# EAGLE design gate-emitter (EAGLE 7.6.0)
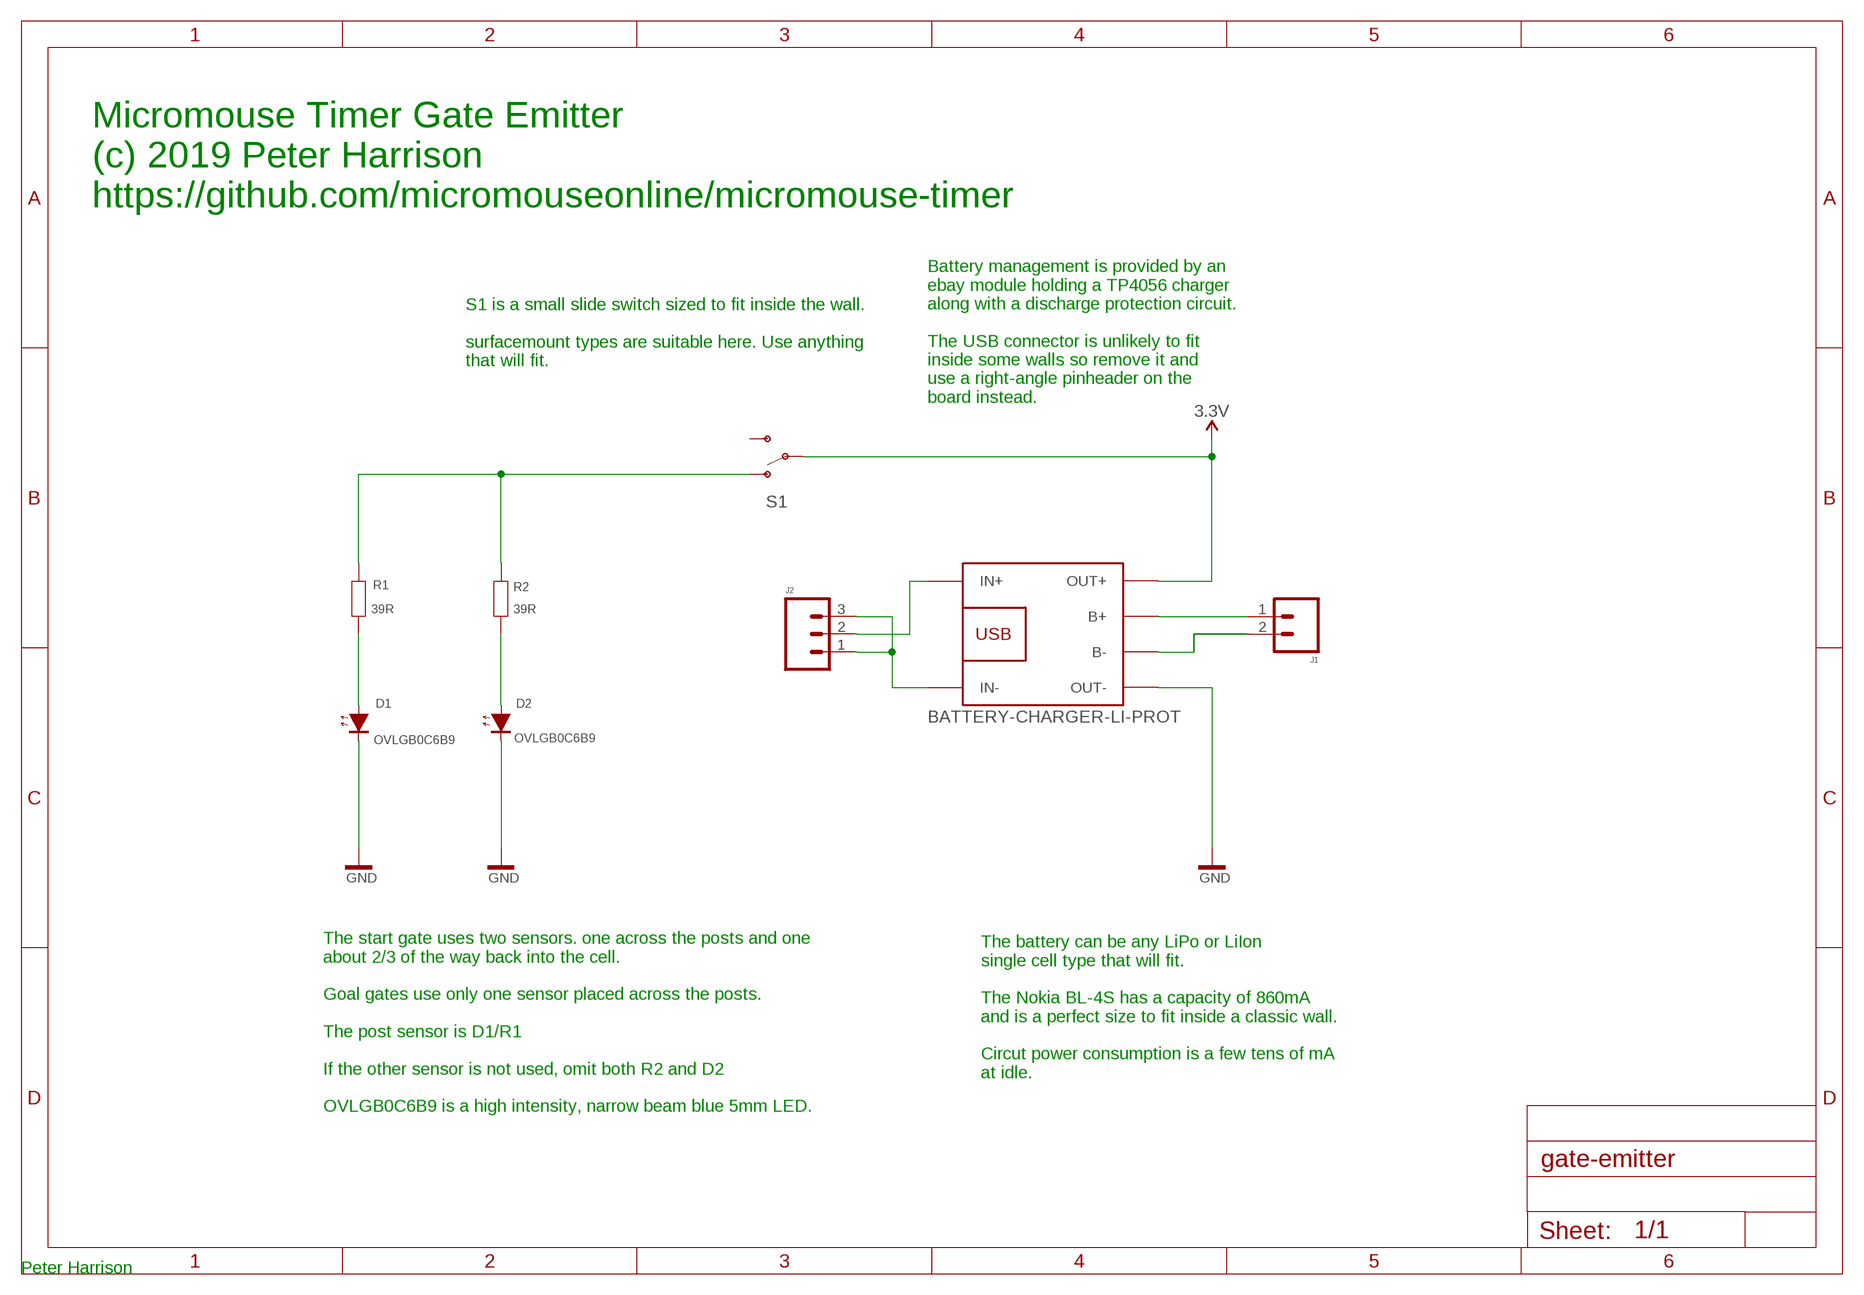
[diagram p0: schematic, sheet 1]
FRAME1 (A4L-LOC): NME: Peter Harrison

## Parts
D1  OVLGB0C6B9  LED  [LED5MM-H]
D2  OVLGB0C6B9  LED  [LED5MM-H]
J1  M02RA_MALE_MILL  [1X02_RA_PTH_MALE_MILL]
J2  M03RA_MALE  [1X03_RA_PTH_MILL]
R1  39R  RESISTOR_AXIAL-0207_0.4  [AXIAL-0207_0.4]
R2  39R  RESISTOR_AXIAL-0207_0.4  [AXIAL-0207_0.4]
S1  SWITCH-SPDT-PTH-11.6X4.0MM  [SWITCH_SPDT_PTH_11.6X4.0MM]
U$2  BATTERY-CHARGER-LI-PROT  [BATTERY-CHARGER-LI-PROT]

## Nets
3.3V: S1.2(P) U$2.OUT+
GND: D1.C D2.C U$2.OUT-
N$1: R1.2 R2.2 S1.1(O)
N$2: J1.1 U$2.B+
N$3: D1.A R1.1
N$4: D2.A R2.1
N$5: J2.2 U$2.IN+
N$6: J2.1 J2.3 U$2.IN-
N$7: J1.2 U$2.B-
Unconnected: S1.3(S)

## Notes on the sheet
- Micromouse Timer Gate Emitter
  (c) 2019 Peter Harrison
  https://github.com/micromouseonline/micromouse-timer
- S1 is a small slide switch sized to fit inside the wall.
  
  surfacemount types are suitable here. Use anything
  that will fit.
- Battery management is provided by an 
  ebay module holding a TP4056 charger 
  along with a discharge protection circuit.
  
  The USB connector is unlikely to fit
  inside some walls so remove it and
  use a right-angle pinheader on the
  board instead.
- The battery can be any LiPo or LiIon 
  single cell type that will fit.
  
  The Nokia BL-4S has a capacity of 860mA
  and is a perfect size to fit inside a classic wall.
  
  Circut power consumption is a few tens of mA 
  at idle.
- The start gate uses two sensors. one across the posts and one
  about 2/3 of the way back into the cell.
  
  Goal gates use only one sensor placed across the posts.
  
  The post sensor is D1/R1
  
  If the other sensor is not used, omit both R2 and D2
  
  OVLGB0C6B9 is a high intensity, narrow beam blue 5mm LED.

## Library data of the parts
D1 D2 = micromouse-timer:LED
J1 = micromouse-timer:M02: 2 pin header/connector
J2 = micromouse-timer:M03: Header 3 Standard 3-pin 0.1" header. Use with straight break away headers (SKU : PRT-00116), right angle break away headers (PRT-00553), swiss pins (PRT-00743), machine pins (PRT-00117), and female headers (PRT-00115). Molex polarized connector foot print use with SKU : PRT-08232 with associated crimp pins and housings.
R1 R2 = micromouse-timer:RESISTOR_: Resistor Basic schematic elements and footprints for 0603, 1206, and PTH 1/10th watt (small) resistors.
S1 = micromouse-timer:SWITCH-SPDT: Single Pole, Double Throw (SPDT) Switch Single-pole, double-throw (SPDT) switch. Variant Overview SMD-AYZ0202 Surface Mount DPDT Switch <https://www.sparkfun.com/products/597> (COM-00597) Used on e.g. LilyPad Arduino USB - ATmega32U4 Board <https://www.sparkfun.com/products/12049> PTH-11.6X4.0MM SPDT Mini Power Switch <https://www.sparkfun.com/products/102> (COM-00102) Used on e.g. SparkFun Simon Says - Through-Hole Soldering Kit <https://www.sparkfun.com/products/10547> (KIT-10547) PTH-11.6X4.0MM-KIT KIT version of SPDT Mini Power Switch - Simplifies soldering by removing tStop of switch pins - only one side can be soldered. PTH-11.6X4.0MM-LOCK LOCK version of SPDT Mini Power Switch - Offset pins hold switch in place for easier soldering. SMD-RIGHT-ANGLE Surface Mount Right Angle Switch <https://www.sparkfun.com/products/10860> (COM-10860) Used on e.g. SparkFun ESP8266 Thing <https://www.sparkfun.com/products/13231>; PROD_ID: SWCH-08261; SF_SKU: COM-00102
U$2 = micromouse-timer:BATTERY-CHARGER-LI-PROT: Lithium Battery 5V Charger with protection circuit More details available here: http://www.instructables.com/id/DIY-Lithium-ion-Battery-Charger/step4/TP4056-based-lithium-ion-battery-charger-module/ Click here to find device on ebay.com <http://www.ebay.com/sch/tp4056+charger+usb+protection>

## Board
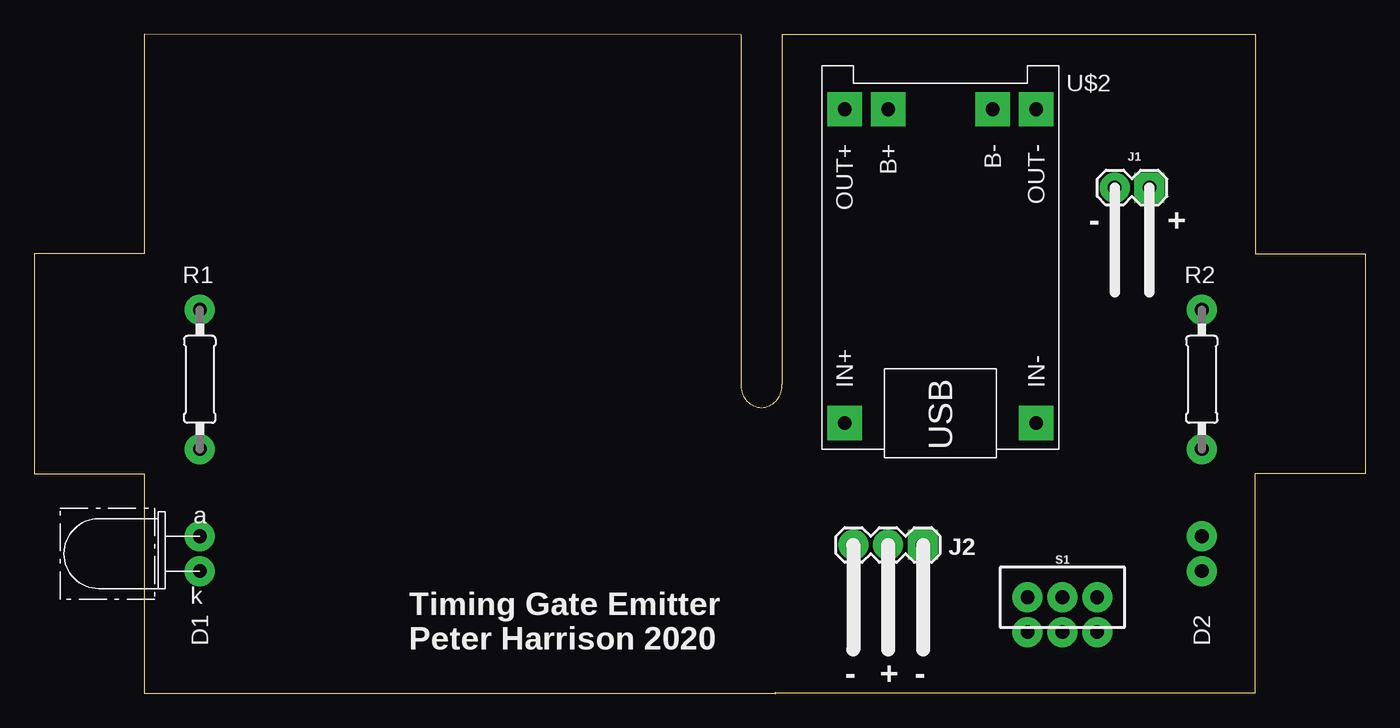
[diagram p1: board, top side]
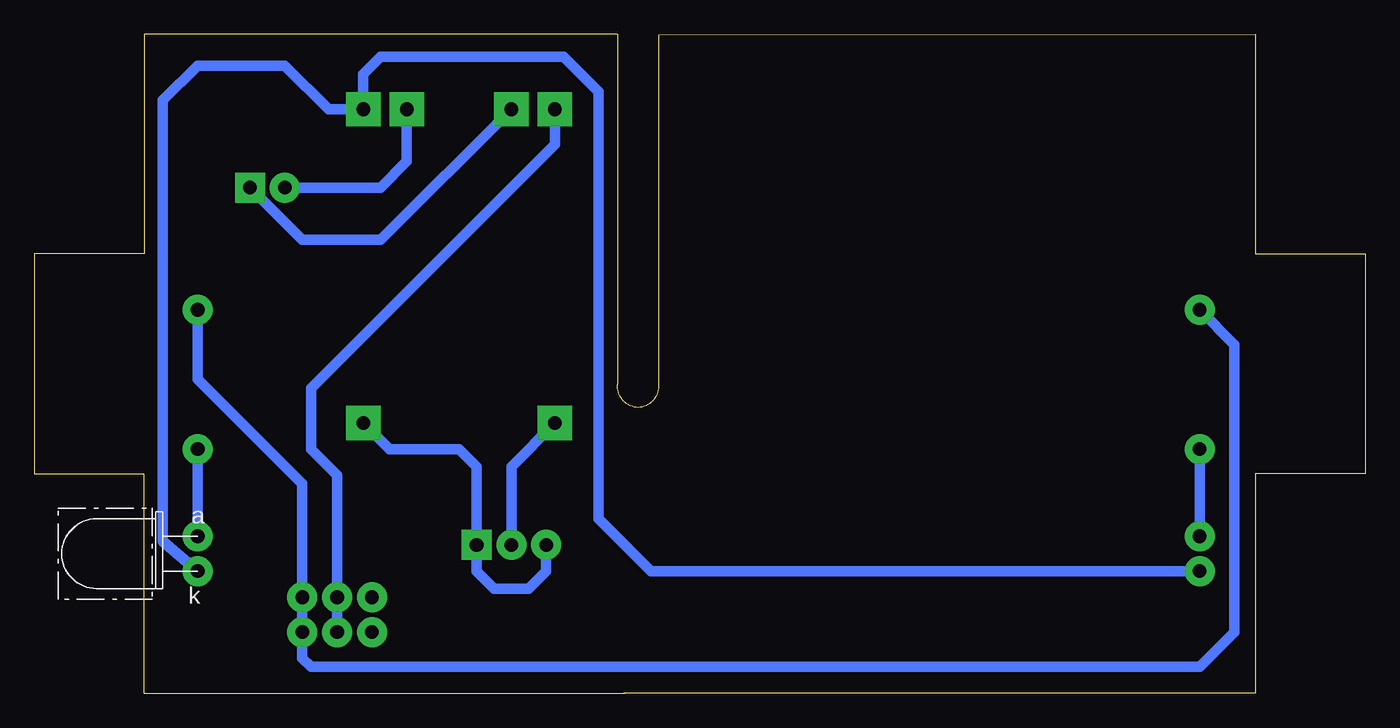
[diagram p2: board, bottom side, seen from below]

Size 97 x 48.03 mm. Coordinates in mm from the lower left corner, seen from the top.
Outline: 54,0.03 8,0.03 8,16.03 0,16.03 0,32.03 8,32.03 8,48.03 51.5,47.99 51.5,22.53 arc90 53,20.83 arc90 54.5,22.53 54.5,48.03 89,48.03 89,32.03 97,32.03 97,16.03 89,16.03 89,0.03 54.01,0.03
Outline: 54,0 arc180 54,0.06
Outline: 54.01,0.06 arc180 54.01,0
Copper layers (1*16): Top 0.035mm / dielectric 1.5mm / Bottom 0.035mm
Design rules "gate-controller-eagle7-V2": minimum track width 30mil, minimum drill 0.8mm, track to track 0.205mm, track to pad 0.205mm, pad to pad 0.205mm, via to via 0.205mm, smd to smd 0mil, copper to edge 0.25mm, drill to drill 6mil, minimum pad ring 10mil, minimum via ring 10mil, stop-mask expansion 1mil, vias tented up to drill 30mil, thermal gap 6mil

### Footprints (pad centres in the part's own frame; a part is rotated, then mirrored left to right if it is on the bottom)
LED5MM-H = drill 1 pad 2.184: A 0,-1.27; C 0,1.27
1X02_RA_PTH_MALE_MILL = drill 1 pad 2.184 square: 1 0,0 | drill 1 pad 2.184: 2 2.54,0
1X03_RA_PTH_MILL = drill 1 pad 2.184 square: 1 0,0 | drill 1 pad 2.184: 2 2.54,0; 3 5.08,0
AXIAL-0207_0.4 = drill 1 pad 2.184: 1 -5.08,0; 2 5.08,0
SWITCH_SPDT_PTH_11.6X4.0MM = drill 1 pad 2.184: 1 0,2.54; 2 0,0; 3 0,-2.54
BATTERY-CHARGER-LI-PROT = drill 1 pad 2.5 square: B+ 10.795,3.81; B- 10.795,-3.81; IN+ -12.065,6.985; IN- -12.065,-6.985; OUT+ 10.795,6.985; OUT- 10.795,-6.985

### Placement (x,y rotation side)
D1  12.06,10.19 180 top
D2  85.09,10.19 180 bottom
J1  81.28,36.86 180 top
J2  64.77,10.83 180 top
R1  12.06,22.89 90 top
R2  85.09,22.89 90 top
S1  74.93,7.02 270 top
U$2  66.04,31.78 90 top

### Tracks (layer width: path | path; a pad name or v marks a point on that pad's centre or on a via)
3.3V  (via drill 1 pad 2.18)
  Bottom 0.762: v74.93,4.48 S1.2 74.93,15.91 76.83,17.81 76.83,22.26 59.05,40.04 U$2.OUT+
GND
  Bottom 0.762: D2.C 87.63,11.08 87.63,43.21 85.09,45.75 78.74,45.75 75.56,42.58 U$2.OUT- 73.03,45.12 71.75,46.39 58.42,46.39 55.88,43.85 55.88,12.73 52.07,8.92 D1.C
N$1  (via drill 1 pad 2.18)
  Bottom 0.762: R1.2 9.53,25.43 9.53,4.48 12.06,1.94 76.83,1.94 77.47,2.57 v77.47,4.48 S1.1 77.47,15.27 85.09,22.89 R2.2
N$2
  Bottom 0.762: J1.1 77.47,33.05 71.75,33.05 U$2.B+
N$3
  Bottom 0.762: R1.1 D1.A
N$4
  Bottom 0.762: R2.1 D2.A
N$5
  Bottom 0.762: U$2.IN+ 62.23,16.54 J2.2
N$6
  Bottom 0.762: J2.3 59.69,8.92 60.96,7.65 63.5,7.65 64.77,8.92 J2.1 64.77,16.54 66.04,17.81 71.12,17.81 U$2.IN-
N$7
  Bottom 0.762: J1.2 71.75,36.86 69.85,38.77 U$2.B-
N$8  (via drill 1 pad 2.18)
  other vias: 72.39,4.48

### Text on the board
tPlace: - | + | Timing Gate Emitter / Peter Harrison 2020 | - | + | -